# Altium schematic sheet DK_POWER.SchDoc
size A4
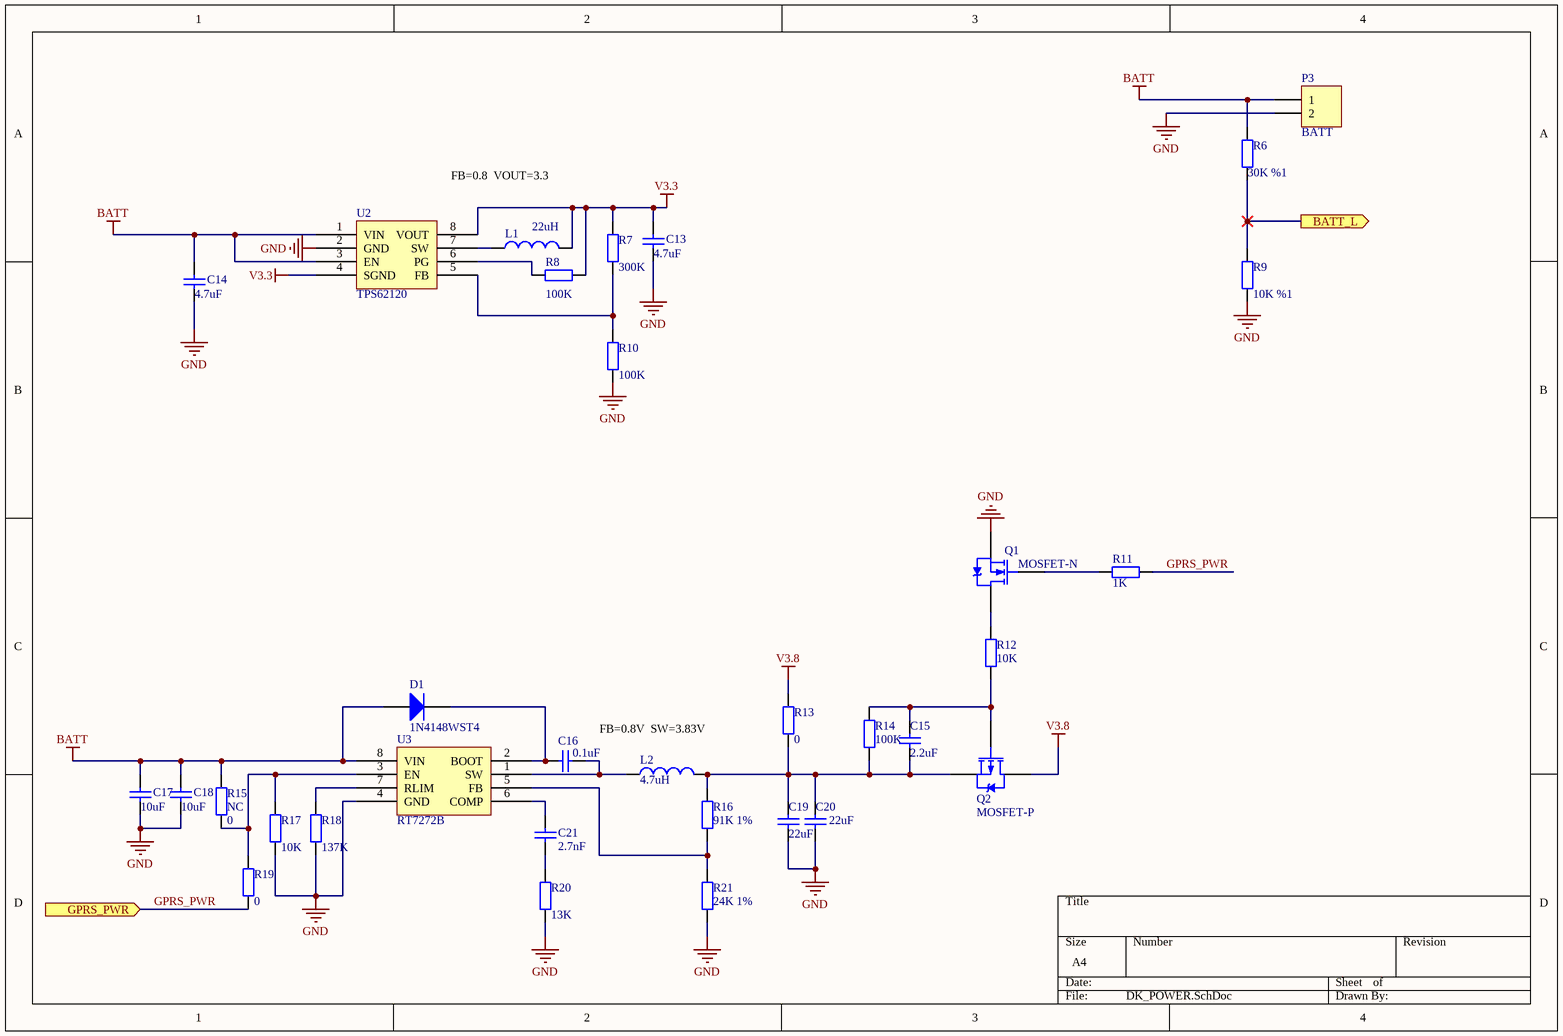
[diagram p0: DK_POWER.SchDoc]

## Parts
C13  value 4.7uF  [0603]  (hidden comment: Cap)
C14  value 4.7uF  [0603]  (hidden comment: Cap)
C15  value 2.2uF  [0603]  (hidden comment: Cap)
C16  value 0.1uF  [0603]  (hidden comment: Cap)
C17  value 10uF  [0603]  (hidden comment: Cap)
C18  value 10uF  [0603]  (hidden comment: Cap)
C19  value 22uF  [0603]  (hidden comment: Cap)
C20  value 22uF  [0603]  (hidden comment: Cap)
C21  value 2.7nF  [0603]  (hidden comment: Cap)
D1  1N4148WST4  [SOD-323]
L1  value 22uH  [0630]  (hidden comment: Inductor)
L2  value 4.7uH  [0630]  (hidden comment: Inductor)
P3  BATT  [HEAD2L-0.8]
Q1  MOSFET-N  [SOT-23A]
Q2  MOSFET-P  [SOT-23A]
R6  value 30K %1  [0603]  (hidden comment: Res2)
R7  value 300K  [0603]  (hidden comment: Res2)
R8  value 100K  [0603]  (hidden comment: Res2)
R9  value 10K %1  [0603]  (hidden comment: Res2)
R10  value 100K  [0603]  (hidden comment: Res2)
R11  value 1K  [0603]  (hidden comment: Res2)
R12  value 10K  [0603]  (hidden comment: Res2)
R13  value 0  [0603]  (hidden comment: NC)
R14  value 100K  [0603]  (hidden comment: Res2)
R15  NC  value 0  [0603]
R16  value 91K 1%  [0603]  (hidden comment: Res2)
R17  value 10K  [0603]  (hidden comment: Res2)
R18  value 137K  [0603]  (hidden comment: Res2)
R19  value 0  [0603]  (hidden comment: Res2)
R20  value 13K  [0603]  (hidden comment: Res2)
R21  value 24K 1%  [0603]  (hidden comment: Res2)
U2  TPS62120  [TPS62120]
U3  RT7272B  [RT7272B]

## Ports
BATT_L (out), GPRS_PWR (in)

## Nets
BATT: C14.2 C17.2 C18.2 D1.1(A) P3.1 R6.2 R15.2 U2.1(VIN) U2.3(EN) U3.8(VIN)
GND: C13.1 C14.1 C17.1 C18.1 C19.1 C20.1 P3.2 Q1.3(S) R9.2 R10.1 R17.1 R18.1 R20.1 R21.1 U2.2(GND) U3.4(GND)
V3.3: C13.2 L1.2 R7.2 R8.2 U2.4(SGND) U2.8(VOUT)
V3.8: Q2.2(D) R13.2
BATT_L: R6.1 R9.1 ; port BATT_L
GPRS_PWR: R11.2 R19.1 ; port GPRS_PWR
NetC15_1: C15.1 C19.2 C20.2 L2.2 Q2.3(S) R13.1 R14.1 R16.2
NetC15_2: C15.2 Q2.1(G) R12.1 R14.2
NetC16_1: C16.1 L2.1 U3.1(SW)
NetC16_2: C16.2 D1.2(K) U3.2(BOOT)
NetC21_1: C21.1 U3.6(COMP)
NetC21_2: C21.2 R20.2
NetL1_1: L1.1 U2.7(SW)
NetQ1_1: Q1.1(G) R11.1
NetQ1_2: Q1.2(D) R12.2
NetR7_1: R7.1 R10.2 U2.5(FB)
NetR8_1: R8.1 U2.6(PG)
NetR15_1: R15.1 R17.2 R19.2 U3.3(EN)
NetR16_1: R16.1 R21.2 U3.5(FB)
NetR18_2: R18.2 U3.7(RLIM)

## Notes on the sheet
- FB=0.8  VOUT=3.3
- FB=0.8V  SW=3.83V

## Library data of the parts
C13-C21 = Cap: Capacitor; Published: 8-Jun-2000; LatestRevisionDate: 17-Jul-2002; LatestRevisionNote: Re-released for DXP Platform.; PackageReference: RAD-0.3; Publisher: Altium Limited; PackageDescription: Radial Cap, Thru-Hole; 2 Leads; 0.3 in Pin Spacing
D1 = Diode: Default Diode; Published: 8-Jun-2000; LatestRevisionDate: 17-Jul-2002; LatestRevisionNote: Re-released for DXP Platform.; PackageVersion: Sep-1996; PackageReference: SMC; Publisher: Altium Limited; PackageDescription: DO-214-AB/SMC; 2 C-Bend Leads; Body 7.9 x 5.9 mm, inc. leads (LxW); Code_JEDEC: DO-214-AB
L1 L2 = Inductor: Code_IEC: 1005; Published: 8-Jun-2000; LatestRevisionDate: 29-May-2009; LatestRevisionNote: IPC-7351 Footprint Added.; PackageReference: 0402-A; Publisher: Altium Limited; PackageDescription: Chip Inductor; Code_JEITA: 0402
P3 = Header 2: Header, 2-Pin; LatestRevisionDate: 17-Jul-2002; LatestRevisionNote: Re-released for DXP Platform.; Publisher: Altium Limited
Q1 = NMOS-2: N-Channel Power MOSFET; Note: Pin 2 is electrically connected to pin 4.; Published: 8-Jun-2000; LatestRevisionDate: 17-Jul-2002; LatestRevisionNote: Re-released for DXP Platform.; DatasheetVersion: PD-9.814; PackageVersion: Feb-1997; PackageReference: TO-220AB; Publisher: Altium Limited; PackageDescription: TO, Thru-Hole, Vertical, Heatsink Mounted; 3 In-Line Leads; Pitch 2.54 mm; ComponentLink1Description: Manufacturer Link; ComponentLink1URL: http://www.irf.com/
Q2 = PMOS-2: P-Channel Power MOSFET; Note: Pin 4 not drawn and electrically connected to Pin 2.; Published: 8-Jun-2000; LatestRevisionDate: 17-Jul-2002; LatestRevisionNote: Re-released for DXP Platform.; DatasheetVersion: PD-9.390D; PackageVersion: Feb-1997; PackageReference: TO-220AB; Publisher: Altium Limited; PackageDescription: TO, Thru-Hole, Vertical, Heatsink Mounted; 3 In-Line Leads; Pitch 2.54 mm; ComponentLink1Description: Manufacturer Link; ComponentLink1URL: http://www.irf.com/
R6-R21 = Res2: Resistor; Published: 8-Jun-2000; LatestRevisionDate: 17-Jul-2002; LatestRevisionNote: Re-released for DXP Platform.; PackageReference: AXIAL-0.4; Publisher: Altium Limited; PackageDescription: Axial Device, Thru-Hole; 2 Leads; 0.4 in Pin Spacing